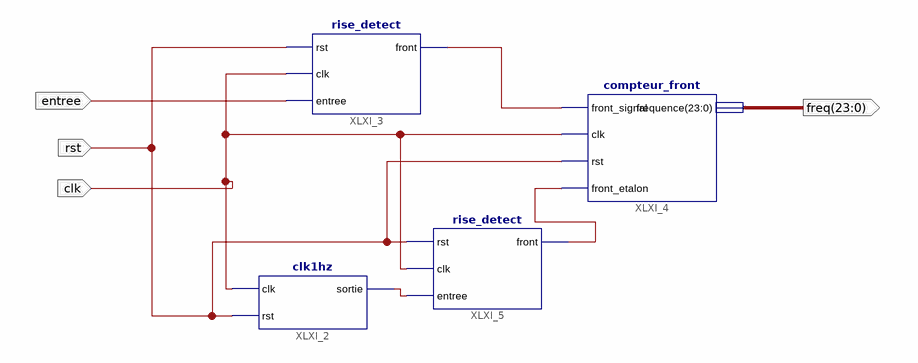
[diagram p0: schematic sheet 1]
// Xilinx ISE schematic etalon.sch (spartan3e) as structural Verilog: 4 symbols, 4 ports
module etalon (
  input  entree,
  input  clk,
  input  rst,
  output [23:0] freq
);

  wire XLXN_1, XLXN_10, XLXN_12;

  clk1hz XLXI_2 (.clk(clk), .rst(rst), .sortie(XLXN_12));
  rise_detect XLXI_3 (.rst(rst), .clk(clk), .entree(entree), .front(XLXN_1));
  compteur_front XLXI_4 (.front_signal(XLXN_1), .clk(clk), .rst(rst), .front_etalon(XLXN_10), .frequence(freq));
  rise_detect XLXI_5 (.rst(rst), .clk(clk), .entree(XLXN_12), .front(XLXN_10));
endmodule
